# Altium schematic sheet Motor Driver.SchDoc
size A4; SheetNumber: 2; SheetTotal: 4
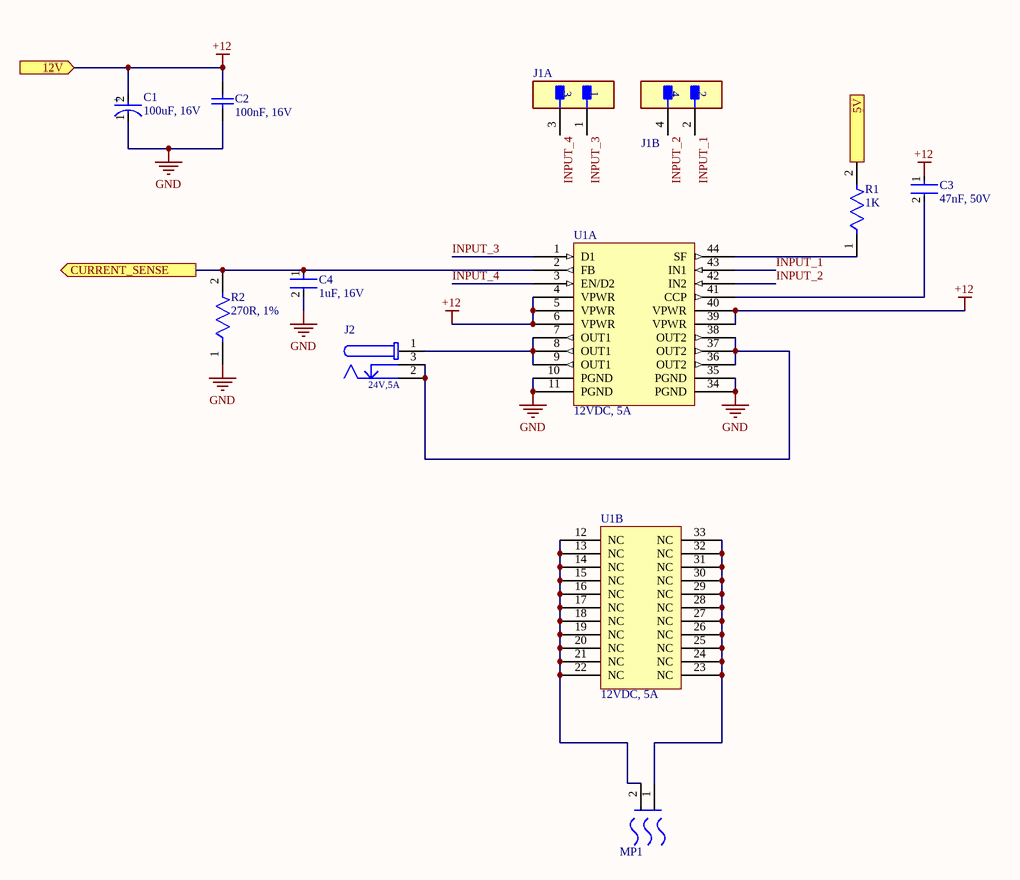
[diagram p0: Motor Driver.SchDoc]

## Parts
C1  100uF, 16V  [FP-TAJF-MFG]
C2  100nF, 16V  [CAPC3216X180X55LL20T25]
C3  47nF, 50V  [FP-0805-L_2_01_0_2-W_1_25-IPC_C]
C4  1uF, 16V  [FP-GCM219-0_15-MFG]
J1  5-146256-2  [FP-5-146256-2-MFG]  (value not drawn)  (parts A,B of 2)
J2  24V,5A  [694106301002]
MP1  R2A-CT4-38E  [FP-R2A-CT4-38E-MFG]  (value not drawn)
R1  1K  [FP-RC0805-0_6-MFG]
R2  270R, 1%  [FP-CR0805-IPC_B]
U1  12VDC, 5A  [SOP65P1420X340_HS-45N]  (parts A,B of 2)

## Ports
5V (in), 12V (in), CURRENT_SENSE (out)

## Nets
+12: C1.2(A) C2.2 C3.1 U1.4(VPWR) U1.5(VPWR) U1.6(VPWR) U1.39(VPWR) U1.40(VPWR) ; port 12V
GND: C1.1(C) C2.1 C4.2 R2.1 U1.10(PGND) U1.11(PGND) U1.34(PGND) U1.35(PGND)
5V: R1.2 ; port 5V
CURRENT_SENSE: C4.1 R2.2 U1.2(FB) ; port CURRENT_SENSE
INPUT_1: J1.2 U1.43(IN1)
INPUT_2: J1.4 U1.42(IN2)
INPUT_3: J1.1 U1.1(D1)
INPUT_4: J1.3 U1.3(EN/D2)
NetC3_2: C3.2 U1.41(CCP)
NetJ2_1: J2.1 U1.7(OUT1) U1.8(OUT1) U1.9(OUT1)
NetJ2_2: J2.2 J2.3 U1.36(OUT2) U1.37(OUT2) U1.38(OUT2)
NetMP1_1: MP1.1 U1.23(NC) U1.24(NC) U1.25(NC) U1.26(NC) U1.27(NC) U1.28(NC) U1.29(NC) U1.30(NC) U1.31(NC) U1.32(NC) U1.33(NC)
NetMP1_2: MP1.2 U1.12(NC) U1.13(NC) U1.14(NC) U1.15(NC) U1.16(NC) U1.17(NC) U1.18(NC) U1.19(NC) U1.20(NC) U1.21(NC) U1.22(NC)
NetR1_1: R1.1 U1.44(SF)

## Notes on the sheet
- (in symbol CMP-04424-000049-1) +

## Library data of the parts
C1 = CMP-04424-000049-1: CAP TANT 100UF 20% 16V 2312; Leakage Current: 16uA; ESR (Equivalent Series Resistance): 400mR; Polarity: Polar; Dissipation Factor: 10%; Dielectric Material: Tantalum; REACH SVHC: No SVHC; Case/Package: Molded; Package Quantity: 1000; Voltage Rating (DC): 16V; Case Code (Imperial): 2412; Voltage: 16V; Voltage Rating: 16V; Capacitance: 100uF; Width: 3.2mm; Radiation Hardening: No; Min Operating Temperature: -55°C; Series: TAJ; Construction: Flat; Max Operating Temperature: 125°C; Tolerance: 20%; Length: 6mm; RoHS Compliant: Yes; Mount: Surface Mount; Case Code (Metric): 6032; Features: General Purpose; Packaging: Tape and Reel; Lead Free: Lead Free; Depth: 3.2mm; Height: 2mm; Termination: SMD/SMT; Height - Seated (Max): 0.079inch
C2 = CMP-2000-06343-1: Chip Capacitor, 100 nF, +/- 5%, 25 V, -55 to 125 degC, 1206 (3216 Metric), RoHS, Tape and Reel; Manufacturer: Murata; External Width: 0.5mm; Voltage Rating V DC: 25V; Capacitor Case Style: 1206[3216Metric]; Insulation Resistance: 10000Mohm; Capacitor Terminals: SMD; Capacitance: 0.1µF; Temperature Coefficient: 0ppm/°C±30ppm/°C; External Length / Height: 1mm; Reel Quantity: 2000; Dielectric Characteristic: C0G/NP0; SVHC: NoSVHC(19-Dec-2012); No. of Pins: 2; Manufacturer URL: http://www.murata.com/; Mounting Technology: SurfaceMount; Operating Temperature Range: -55°Cto+125°C; Operating Temperature Max: 125°C; Package Description: 2-Pin Surface Mount Device, Body 3.2 x 1.6 mm; Operating Temperature Min: -55°C; Terminal Type: SurfaceMount(SMD,SMT); MSL: –; Tolerance +: 5%; Voltage Rating: 25V; Datasheet URL: https://datasheet.ciiva.com/3777/11308grm31c5c1e104ja0123-3777177.pdf; Datasheet Version: 09/2014; Package / Case: 1206; Capacitance Tolerance: ±5%; Package Reference: 1206; Lead Spacing: –; Tolerance -: 5%
C3 = CMP-2007-04427-2: General Purpose Ceramic Capacitor, 0805, 47nF, 10%, X7R, 0.15, 50V; Insulation Resistance: 100GR; Dissipation Factor: 2.5%; Case/Package: 0805; Package Quantity: 1; Lead Free: Lead Free; Length: 2.01mm; Series: -; Packaging: Tape and Reel; Thickness: 0.037inch; Voltage: 50V; REACH SVHC: No SVHC; Contact Plating: Tin; Tolerance: 10%; Radiation Hardening: No; Case Code (Imperial): 0805; Min Operating Temperature: -55°C; Voltage Rating: 50V; Number of Pins: 2; Case Code (Metric): 2012; Capacitance: 47nF; Termination: SMD/SMT; Dielectric: X7R; Mount: Surface Mount; Height: 0.94mm; Depth: 1.25mm; Width: 1.25mm; Construction: Flat; RoHS Compliant: Yes; Voltage Rating (DC): 50V; Max Operating Temperature: 125°C
C4 = CMP-2007-00086-2: Ceramic Capacitor for Automotive 1uF  ±10% 16VDC X7R 0805 Paper T/R; Thickness: 0.037inch; Height: 0.85mm; Capacitance: 1uF; Tolerance: 10%; Width: 0.049inch; Min Operating Temperature: -55°C; Case Code (Metric): 2012; Voltage: 16V; Mount: Surface Mount; Ratings: AEC-Q200; Termination: SMD/SMT; Lead Free: Lead Free; Voltage Rating (DC): 16V; Dielectric: X7R; Voltage Rating: 16V; Package Quantity: 4000; Max Operating Temperature: 125°C; Length: 2mm; Radiation Hardening: No; Depth: 1.25mm; Packaging: Tape and Reel; Case/Package: 0805; Case Code (Imperial): 0805
J1 = CMP-03369-000128-1: CONN HEADER VERT 4POS 2.54MM; Connector Type: Plug; Number of Positions: 4; High Speed Serial Data Connector: No; High Temperature Housing: Yes; Strain Relief: No (Without); Contact Current Rating: 3A; Board Standoff: Yes (With); PCB Mounting Orientation: Vertical; PCB Mount Retention: Without; Contact Post Length: 0.12inch; PCB Thickness: 0.062inch; Approvals: CSA; Voltage Rating: 750V; Insulation Resistance: 5GR; Radiation Hardening: No; Packaging: Carton; Housing Color: Black; Contact Material: Bronze; Depth: 4.88mm; Row Spacing: 2.54mm; Number of Contacts: 4; Contact Shape: Square; Contact Type: Male Pin; Min Operating Temperature: -65°C; Pitch: 2.54mm; Flammability Rating: UL94 V-0; Keyed: No; Housing Material: Thermoplastic; Mount: Through Hole; Length: 4.67mm; Mating Connector Lock: No (Without); Selectively Loaded: No (Without); Contact Mating Length: 0.23inch; Contact Protection: No (Without); Contact Gender: Male; Current Rating: 3A; Number of Rows: 2; Termination: Through Hole; Color: Black; RoHS Compliant: Yes; Gasket: No (Without); Contact Plating: Gold; Max Operating Temperature: 105°C; Mating Alignment: No (Without); Series: AMPMODU MOD II; Orientation: Straight; Package Quantity: 500; Stabilizers: No (Without)
J2 = CMP-1502-00188-1: DC Power Jack Connector WR-DC, Male, Right Angled, THT, 5 A, 24 V; Manufacturer: Wurth Elektronik; Plug Inner Diameter: 2.05mm; Opening Diameter: 6.4mm; Plug Outer Diameter: 5.5mm; Datasheet URL: http://katalog.we-online.de/em/datasheet/6941xx301002.pdf; Packaging: Bag; Manufacturer URL: http://www.we-online.de; Part Number: 694106301002; Rated Current: 5A; Gender: Male; Publisher: WurthElektronik; Operating Temperature: -40to85degC; Mounting Technology: THT; Package Reference: 694106301002; Working Voltage: 24V; Orientation: RightAngled
MP1 = CMP-33535-000008-1: HEATSINK FOR TO-247; Thermal Resistance @ Forced Air Flow (100 LFM): 1°C/W; Shape: Fins; Finish: Anodized; Natural Thermal Resistance: 8.6°C/W; Material: Aluminium; Type: Passive; Weight: 6.4oz; Lead Free: Lead Free; Package Cooled: TO-247; Width: 1.38inch; Case/Package: TO-247; Color: Black; Series: R2; RoHS Compliant: Yes; Height Off Base: 0.87inch; Mount: Clip; Height: 22mm; Length: 1.5inch; Package Quantity: 5
R1 = CMP-03412-037820-1: RES SMD 1K OHM 5% 1/8W 0805; Voltage Rating: 150V; Resistance: 1kR; Max Power Dissipation: 125mW; Temperature Coefficient: 100ppm/°C; Size Code: 0805; Series: RC; Number of Terminations: 2; Tolerance: 5%; Features: Moisture Resistant; Termination: SMD/SMT; Min Operating Temperature: -55°C; Construction: Rectangular; Lead Free: Lead Free; Contact Plating: Tin; Radiation Hardening: No; Packaging: Tape and Reel; Length: 2mm; Resistor Type: Thick Film; Military Standard: Not; Case Code (Metric): 2012; Depth: 1.25mm; Case Code (Imperial): 0805; Power Rating: 125mW; Max Operating Temperature: 155°C; Resistance Tolerance: 5%; RoHS Compliant: Yes; Case/Package: 0805
R2 = CMP-07231-005969-1: Thick Film Chip Resistors 0805 270Ω 0.125W 1% 100ppm/°C; Voltage Rating: 150V; Power Rating: 125mW; Number of Terminations: 2; Composition: Thick Film; Military Standard: Not; Min Operating Temperature: -55°C; Tolerance: 1%; Case Code (Metric): 2012; Max Operating Temperature: 155°C; Contact Plating: Tin; Depth: 1.25mm; Height: 0.024inch; Thickness: 508um; Termination: SMD/SMT; Resistance: 270R; Package Quantity: 5000; Length: 2mm; Width: 1.25mm; Case Code (Imperial): 0805; Features: Moisture Resistant; Temperature Coefficient: 100ppm/°C; Radiation Hardening: No; Packaging: Tape and Reel; Mount: Surface Mount; Case/Package: 0805; Max Power Dissipation: 125mW
U1 = MC33931VWR2: - Motor Driver CMOS Parallel 44-HSOP